# EAGLE board ION-60 (EAGLE 6.5.0), part 1 of 2
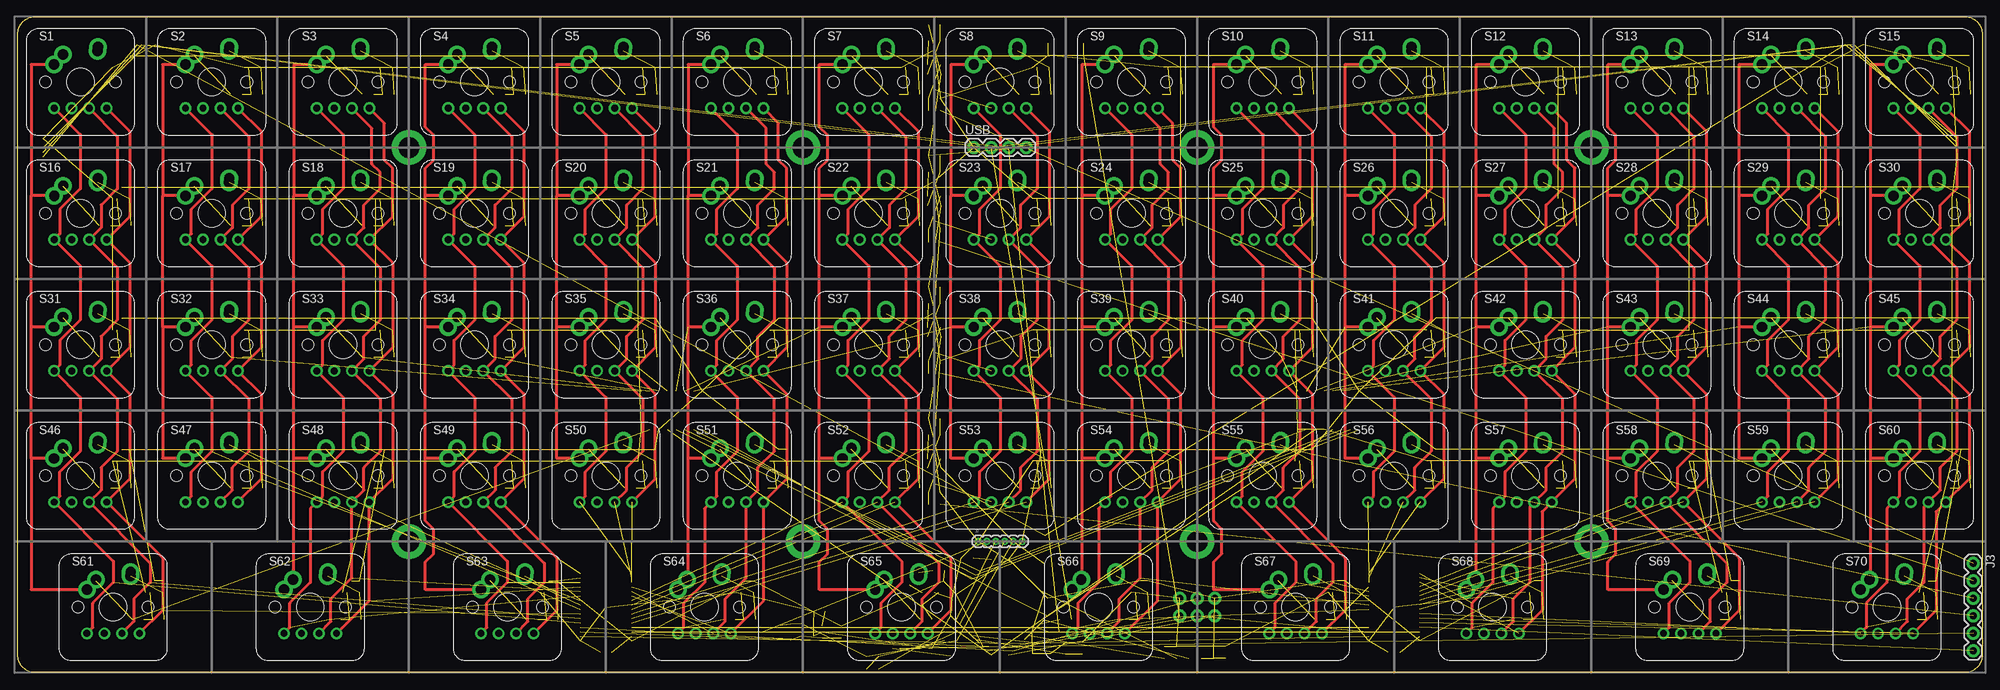
[diagram p2: board, top side]
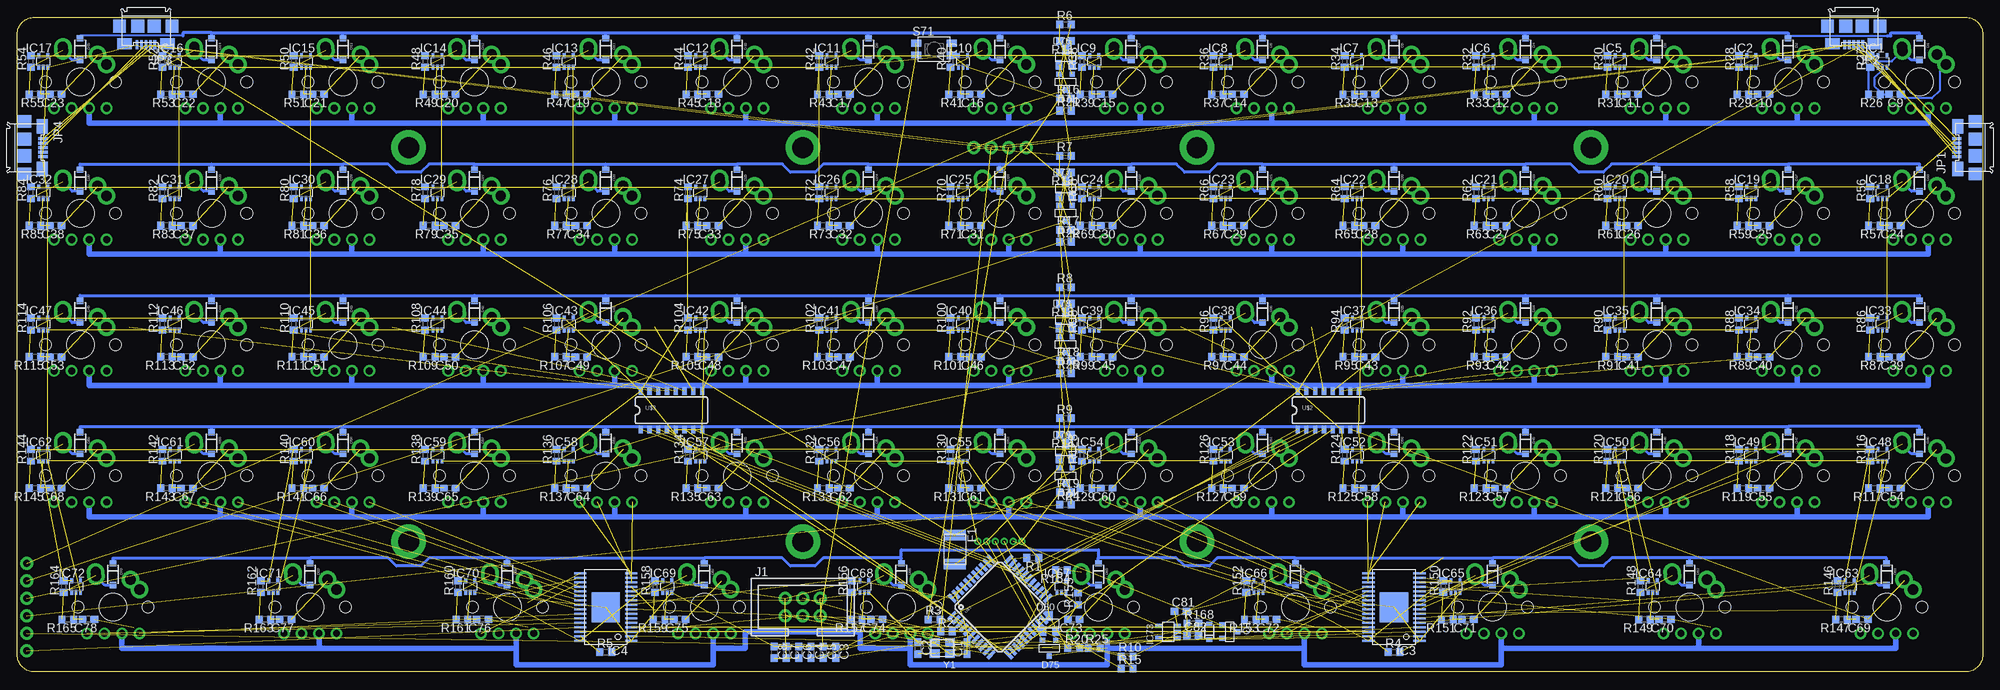
[diagram p3: board, bottom side, seen from below]

Size 285 x 95 mm. Coordinates in mm from the lower left corner, seen from the top.
Outline: 0,92.5 0,2.5 arc90 2.5,0 282.5,0 arc90 285,2.5 285,92.5 arc90 282.5,95 2.5,95 arc90 0,92.5
Copper layers (1*16): Top 0.035mm / dielectric 1.5mm / Bottom 0.035mm
Design rules "OSH Park 2-Layer DRC": minimum track width 8mil, minimum drill 13mil, track to track 6mil, track to pad 6mil, pad to pad 6mil, via to via 6mil, smd to smd 6mil, copper to edge 15mil, drill to drill 6mil, minimum pad ring 10mil, minimum via ring 7mil, stop-mask expansion 0mil, vias tented up to drill 16mil, thermal gap 10mil

## Footprints (pad centres in the part's own frame; a part is rotated, then mirrored left to right if it is on the bottom)
C0603 = smd 1.1 x 1: 1 -0.85,0; 2 0.85,0
SOD-123 = smd 0.9 x 0.95: A 1.575,0; C -1.575,0
SUPERSOT-3 = smd 0.762 x 0.762: 1 -0.953,-1.143; 2 0.953,-1.143; 3 0,1.143
SOT23 = smd 1 x 1.4: 1 -0.95,-1.1; 2 0.95,-1.1; 3 0,1.1
SOD-323 = smd 0.63 x 0.83: A 1.15,0; C -1.15,0
FUSE-1812 = smd 1.5 x 3.2: 1 -2.1,0; 2 2.1,0
SC70-5 = smd 0.4 x 0.7: 1 -0.65,-0.85; 2 0,-0.85; 3 0.65,-0.85; 4 0.65,0.85; 5 -0.65,0.85
HTSSOP-32 = smd 1.8 x 0.3: 1 -3.7,4.875; 2 -3.7,4.225; 3 -3.7,3.575; 4 -3.7,2.925; 5 -3.7,2.275; 6 -3.7,1.625; 7 -3.7,0.975; 8 -3.7,0.325; 9 -3.7,-0.325; 10 -3.7,-0.975; 11 -3.7,-1.625; 12 -3.7,-2.275; 13 -3.7,-2.925; 14 -3.7,-3.575; 15 -3.7,-4.225; 16 -3.7,-4.875; 17 3.7,-4.875; 18 3.7,-4.225; 19 3.7,-3.575; 20 3.7,-2.925; 21 3.7,-2.275; 22 3.7,-1.625; 23 3.7,-0.975; 24 3.7,-0.325; 25 3.7,0.325; 26 3.7,0.975; 27 3.7,1.625; 28 3.7,2.275; 29 3.7,2.925; 30 3.7,3.575; 31 3.7,4.225; 32 3.7,4.875 | smd 4.11 x 4.36: PAD 0,0
SOT23-5 = smd 0.55 x 1: 1 -0.85,-1.35; 2 0,-1.35; 3 0.85,-1.35; 4 0.85,1.35; 5 -0.85,1.35
M-2X03-0.1-PTH-SHROUDED = drill 1.016 pad 1.88: 1 -2.54,-1.27; 2 -2.54,1.27; 3 0,-1.27; 4 0,1.27; 5 2.54,-1.27; 6 2.54,1.27
M-1X06-0.05-PTH = drill 0.508 pad 1: 1 -3.175,0; 2 -1.905,0; 3 -0.635,0; 4 0.635,0; 5 1.905,0; 6 3.175,0
M-1X06-0.1-PTH = drill 1.016 pad 1.88: 1 -6.35,0; 2 -3.81,0; 3 -1.27,0; 4 1.27,0; 5 3.81,0; 6 6.35,0
USB-MICRO-B-SMD = smd 0.4 x 1.35: D+ 0,4.125; D- -0.65,4.125; GND 1.3,4.125; ID 0.65,4.125; VBUS -1.3,4.125 | smd 2.1 x 1.6: P$1 -3.1,4; P$2 3.1,4 | smd 1.8 x 1.9: P$3 -3.8,1.45; P$6 3.8,1.45 | smd 1.9 x 1.9: P$4 -1.2,1.45; P$5 1.2,1.45
R0603 = smd 1 x 1.1: 1 -0.85,0; 2 0.85,0
CHERRY-MX-LED-1X1 = drill 1 pad 1.7: D1 -3.81,-3.81; D2 3.81,-3.81; LED1 -1.27,-3.81; LED2 1.27,-3.81 | drill 1.5 pad 2.54: SW1 -3.81,2.54; SW2 2.54,5.08; SW3 -2.5,4; SW4 2.5,4.5 | hole 4: 0,0 | hole 1.7: -5.08,0; 5.08,0
CHERRY-MX-LED-1X1.5 = drill 1 pad 1.7: D1 -3.81,-3.81; D2 3.81,-3.81; LED1 -1.27,-3.81; LED2 1.27,-3.81 | drill 1.5 pad 2.54: SW1 -3.81,2.54; SW2 2.54,5.08; SW3 -2.5,4; SW4 2.5,4.5 | hole 4: 0,0 | hole 1.7: -5.08,0; 5.08,0
SWITCH-TACTILE-SMD = smd 1.45 x 1: 1 2.575,0.85; 2 2.575,-0.85; 3 -2.575,0.85; 4 -2.575,-0.85
TQFP44 = smd 1.5 x 0.5: 1 -5.8,4; 2 -5.8,3.2; 3 -5.8,2.4; 4 -5.8,1.6; 5 -5.8,0.8; 6 -5.8,0; 7 -5.8,-0.8; 8 -5.8,-1.6; 9 -5.8,-2.4; 10 -5.8,-3.2; 11 -5.8,-4; 23 5.8,-4; 24 5.8,-3.2; 25 5.8,-2.4; 26 5.8,-1.6; 27 5.8,-0.8; 28 5.8,0; 29 5.8,0.8; 30 5.8,1.6; 31 5.8,2.4; 32 5.8,3.2; 33 5.8,4 | smd 0.5 x 1.5: 12 -4,-5.8; 13 -3.2,-5.8; 14 -2.4,-5.8; 15 -1.6,-5.8; 16 -0.8,-5.8; 17 0,-5.8; 18 0.8,-5.8; 19 1.6,-5.8; 20 2.4,-5.8; 21 3.2,-5.8; 22 4,-5.8; 34 4,5.8; 35 3.2,5.8; 36 2.4,5.8; 37 1.6,5.8; 38 0.8,5.8; 39 0,5.8; 40 -0.8,5.8; 41 -1.6,5.8; 42 -2.4,5.8; 43 -3.2,5.8; 44 -4,5.8
SO016 = smd 0.6 x 1.2: 1 -4.445,-2.8; 2 -3.175,-2.8; 3 -1.905,-2.8; 4 -0.635,-2.8; 5 0.635,-2.8; 6 1.905,-2.8; 7 3.175,-2.8; 8 4.445,-2.8; 9 4.445,2.8; 10 3.175,2.8; 11 1.905,2.8; 12 0.635,2.8; 13 -0.635,2.8; 14 -1.905,2.8; 15 -3.175,2.8; 16 -4.445,2.8
M-1X04-0.1-PTH = drill 1.016 pad 1.88: 1 -3.81,0; 2 -1.27,0; 3 1.27,0; 4 3.81,0
CRYSTAL-SMD-3.2X2.5 = smd 1.4 x 1.2: 1 -1.1,-0.8; 2 1.1,-0.8; 3 1.1,0.8; 4 -1.1,0.8

## Placement (x,y rotation side)
C1  [C0603]  147.28,3.45 90 bottom
C2  [C0603]  154.43,3.45 270 bottom
C3  1uF  [C0603]  166.33,2.86 270 bottom
C4  1uF  [C0603]  169.9,2.86 270 bottom
C5  0.1uF  [C0603]  168.12,2.86 270 bottom
C6  0.1uF  [C0603]  171.69,2.86 270 bottom
C7  0.1uF  [C0603]  173.47,2.86 270 bottom
C8  0.1uF  [C0603]  175.26,2.86 270 bottom
C9  1uF  [C0603]  12.74,83.82 180 bottom
C10  1uF  [C0603]  31.79,83.82 180 bottom
C11  1uF  [C0603]  50.84,83.82 180 bottom
C12  1uF  [C0603]  69.89,83.82 180 bottom
C13  1uF  [C0603]  88.94,83.82 180 bottom
C14  1uF  [C0603]  107.99,83.82 180 bottom
C15  1uF  [C0603]  127.04,83.82 180 bottom
C16  1uF  [C0603]  146.09,83.82 180 bottom
C17  1uF  [C0603]  165.14,83.82 180 bottom
C18  1uF  [C0603]  184.19,83.82 180 bottom
C19  1uF  [C0603]  203.24,83.82 180 bottom
C20  1uF  [C0603]  222.29,83.82 180 bottom
C21  1uF  [C0603]  241.34,83.82 180 bottom
C22  1uF  [C0603]  260.39,83.82 180 bottom
C23  1uF  [C0603]  279.44,83.82 180 bottom
C24  1uF  [C0603]  12.74,64.77 180 bottom
C25  1uF  [C0603]  31.79,64.77 180 bottom
C26  1uF  [C0603]  50.84,64.77 180 bottom
C27  1uF  [C0603]  69.89,64.77 180 bottom
C28  1uF  [C0603]  88.94,64.77 180 bottom
C29  1uF  [C0603]  107.99,64.77 180 bottom
C30  1uF  [C0603]  127.04,64.77 180 bottom
C31  1uF  [C0603]  146.09,64.77 180 bottom
C32  1uF  [C0603]  165.14,64.77 180 bottom
C33  1uF  [C0603]  184.19,64.77 180 bottom
C34  1uF  [C0603]  203.24,64.77 180 bottom
C35  1uF  [C0603]  222.29,64.77 180 bottom
C36  1uF  [C0603]  241.34,64.77 180 bottom
C37  1uF  [C0603]  260.39,64.77 180 bottom
C38  1uF  [C0603]  279.44,64.77 180 bottom
C39  1uF  [C0603]  12.74,45.72 180 bottom
C40  1uF  [C0603]  31.79,45.72 180 bottom
C41  1uF  [C0603]  50.84,45.72 180 bottom
C42  1uF  [C0603]  69.89,45.72 180 bottom
C43  1uF  [C0603]  88.94,45.72 180 bottom
C44  1uF  [C0603]  107.99,45.72 180 bottom
C45  1uF  [C0603]  127.04,45.72 180 bottom
C46  1uF  [C0603]  146.09,45.72 180 bottom
C47  1uF  [C0603]  165.14,45.72 180 bottom
C48  1uF  [C0603]  184.19,45.72 180 bottom
C49  1uF  [C0603]  203.24,45.72 180 bottom
C50  1uF  [C0603]  222.29,45.72 180 bottom
C51  1uF  [C0603]  241.34,45.72 180 bottom
C52  1uF  [C0603]  260.39,45.72 180 bottom
C53  1uF  [C0603]  279.44,45.72 180 bottom
C54  1uF  [C0603]  12.74,26.67 180 bottom
C55  1uF  [C0603]  31.79,26.67 180 bottom
C56  1uF  [C0603]  50.84,26.67 180 bottom
C57  1uF  [C0603]  69.89,26.67 180 bottom
C58  1uF  [C0603]  88.94,26.67 180 bottom
C59  1uF  [C0603]  107.99,26.67 180 bottom
C60  1uF  [C0603]  127.04,26.67 180 bottom
C61  1uF  [C0603]  146.09,26.67 180 bottom
C62  1uF  [C0603]  165.14,26.67 180 bottom
C63  1uF  [C0603]  184.19,26.67 180 bottom
C64  1uF  [C0603]  203.24,26.67 180 bottom
C65  1uF  [C0603]  222.29,26.67 180 bottom
C66  1uF  [C0603]  241.34,26.67 180 bottom
C67  1uF  [C0603]  260.39,26.67 180 bottom
C68  1uF  [C0603]  279.44,26.67 180 bottom
C69  1uF  [C0603]  17.5,7.62 180 bottom
C70  1uF  [C0603]  46.08,7.62 180 bottom
C71  1uF  [C0603]  74.65,7.62 180 bottom
C72  1uF  [C0603]  103.23,7.62 180 bottom
C73  1uF  [C0603]  131.8,7.62 180 bottom
C74  1uF  [C0603]  160.38,7.62 180 bottom
C75  1uF  [C0603]  188.95,7.62 180 bottom
C76  1uF  [C0603]  217.53,7.62 180 bottom
C77  1uF  [C0603]  246.1,7.62 180 bottom
C78  1uF  [C0603]  274.68,7.62 180 bottom
C81  470pF  [C0603]  116.33,8.81 0 bottom
C82  1uF  [C0603]  114.54,5.24 0 bottom
D1  [SOD-123]  9.17,90.37 270 bottom
D2  [SOD-123]  28.22,90.37 270 bottom
D3  [SOD-123]  47.27,90.37 270 bottom
D4  [SOD-123]  66.32,90.37 270 bottom
D5  [SOD-123]  85.37,90.37 270 bottom
D6  [SOD-123]  104.42,90.37 270 bottom
D7  [SOD-123]  123.47,90.37 270 bottom
D8  [SOD-123]  142.52,90.37 270 bottom
D9  [SOD-123]  161.57,90.37 270 bottom
D10  [SOD-123]  180.62,90.37 270 bottom
D11  [SOD-123]  199.67,90.37 270 bottom
D12  [SOD-123]  218.72,90.37 270 bottom
D13  [SOD-123]  237.77,90.37 270 bottom
D14  [SOD-123]  256.82,90.37 270 bottom
D15  [SOD-123]  275.87,90.37 270 bottom
D16  [SOD-123]  9.17,71.32 270 bottom
D17  [SOD-123]  28.22,71.32 270 bottom
D18  [SOD-123]  47.27,71.32 270 bottom
D19  [SOD-123]  66.32,71.32 270 bottom
D20  [SOD-123]  85.37,71.32 270 bottom
D21  [SOD-123]  104.42,71.32 270 bottom
D22  [SOD-123]  123.47,71.32 270 bottom
D23  [SOD-123]  142.52,71.32 270 bottom
D24  [SOD-123]  161.57,71.32 270 bottom
D25  [SOD-123]  180.62,71.32 270 bottom
D26  [SOD-123]  199.67,71.32 270 bottom
D27  [SOD-123]  218.72,71.32 270 bottom
D28  [SOD-123]  237.77,71.32 270 bottom
D29  [SOD-123]  256.82,71.32 270 bottom
D30  [SOD-123]  275.87,71.32 270 bottom
D31  [SOD-123]  9.17,52.27 270 bottom
D32  [SOD-123]  28.22,52.27 270 bottom
D33  [SOD-123]  47.27,52.27 270 bottom
D34  [SOD-123]  66.32,52.27 270 bottom
D35  [SOD-123]  85.37,52.27 270 bottom
D36  [SOD-123]  104.42,52.27 270 bottom
D37  [SOD-123]  123.47,52.27 270 bottom
D38  [SOD-123]  142.52,52.27 270 bottom
D39  [SOD-123]  161.57,52.27 270 bottom
D40  [SOD-123]  180.62,52.27 270 bottom
D41  [SOD-123]  199.67,52.27 270 bottom
D42  [SOD-123]  218.72,52.27 270 bottom
D43  [SOD-123]  237.77,52.27 270 bottom
D44  [SOD-123]  256.82,52.27 270 bottom
D45  [SOD-123]  275.87,52.27 270 bottom
D46  [SOD-123]  9.17,33.22 270 bottom
D47  [SOD-123]  28.22,33.22 270 bottom
D48  [SOD-123]  47.27,33.22 270 bottom
D49  [SOD-123]  66.32,33.22 270 bottom
D50  [SOD-123]  85.37,33.22 270 bottom
D51  [SOD-123]  104.42,33.22 270 bottom
D52  [SOD-123]  123.47,33.22 270 bottom
D53  [SOD-123]  142.52,33.22 270 bottom
D54  [SOD-123]  161.57,33.22 270 bottom
D55  [SOD-123]  180.62,33.22 270 bottom
D56  [SOD-123]  199.67,33.22 270 bottom
D57  [SOD-123]  218.72,33.22 270 bottom
D58  [SOD-123]  237.77,33.22 270 bottom
D59  [SOD-123]  256.82,33.22 270 bottom
D60  [SOD-123]  275.87,33.22 270 bottom
D61  [SOD-123]  13.93,14.17 270 bottom
D62  [SOD-123]  42.51,14.17 270 bottom
D63  [SOD-123]  71.08,14.17 270 bottom
D64  [SOD-123]  99.66,14.17 270 bottom
D65  [SOD-123]  128.23,14.17 270 bottom
D66  [SOD-123]  156.81,14.17 270 bottom
D67  [SOD-123]  185.38,14.17 270 bottom
D68  [SOD-123]  213.96,14.17 270 bottom
D69  [SOD-123]  242.53,14.17 270 bottom
D70  [SOD-123]  271.11,14.17 270 bottom
D71  MOSFET-PSUPERSOT  [SUPERSOT-3]  132.99,85.61 180 bottom
D72  MOSFET-PSUPERSOT  [SUPERSOT-3]  132.99,66.56 180 bottom
D73  MOSFET-PSUPERSOT  [SUPERSOT-3]  132.99,47.51 180 bottom
D74  MOSFET-PSUPERSOT  [SUPERSOT-3]  132.99,28.46 180 bottom
D75  MOSFET-PSUPERSOT  [SUPERSOT-3]  135.38,3.45 180 bottom
D76  [SOT23]  132.99,89.18 0 bottom
D77  [SOT23]  132.99,70.13 0 bottom
D78  [SOT23]  132.99,51.08 0 bottom
D79  [SOT23]  132.99,32.03 0 bottom
D80  [SOT23]  135.38,7.03 0 bottom
D81  BAT20J  [SOD-323]  112.16,5.83 90 bottom
F1  500mA  [FUSE-1812]  149.07,17.74 270 bottom
IC1  74LVC1G14DCK  [SC70-5]  14.53,88.58 0 bottom
IC2  74LVC1G14DCK  [SC70-5]  33.58,88.58 0 bottom
IC3  TLC5947DAP  [HTSSOP-32]  85.37,9.41 180 bottom
IC4  TLC5947DAP  [HTSSOP-32]  199.67,9.41 180 bottom
IC5  74LVC1G14DCK  [SC70-5]  52.63,88.58 0 bottom
IC6  74LVC1G14DCK  [SC70-5]  71.68,88.58 0 bottom
IC7  74LVC1G14DCK  [SC70-5]  90.73,88.58 0 bottom
IC8  74LVC1G14DCK  [SC70-5]  109.78,88.58 0 bottom
IC9  74LVC1G14DCK  [SC70-5]  128.83,88.58 0 bottom
IC10  74LVC1G14DCK  [SC70-5]  147.88,88.58 0 bottom
IC11  74LVC1G14DCK  [SC70-5]  166.93,88.58 0 bottom
IC12  74LVC1G14DCK  [SC70-5]  185.98,88.58 0 bottom
IC13  74LVC1G14DCK  [SC70-5]  205.03,88.58 0 bottom
IC14  74LVC1G14DCK  [SC70-5]  224.08,88.58 0 bottom
IC15  74LVC1G14DCK  [SC70-5]  243.13,88.58 0 bottom
IC16  74LVC1G14DCK  [SC70-5]  262.18,88.58 0 bottom
IC17  74LVC1G14DCK  [SC70-5]  281.23,88.58 0 bottom
IC18  74LVC1G14DCK  [SC70-5]  14.53,69.53 0 bottom
IC19  74LVC1G14DCK  [SC70-5]  33.58,69.53 0 bottom
IC20  74LVC1G14DCK  [SC70-5]  52.63,69.53 0 bottom
IC21  74LVC1G14DCK  [SC70-5]  71.68,69.53 0 bottom
IC22  74LVC1G14DCK  [SC70-5]  90.73,69.53 0 bottom
IC23  74LVC1G14DCK  [SC70-5]  109.78,69.53 0 bottom
IC24  74LVC1G14DCK  [SC70-5]  128.83,69.53 0 bottom
IC25  74LVC1G14DCK  [SC70-5]  147.88,69.53 0 bottom
IC26  74LVC1G14DCK  [SC70-5]  166.93,69.53 0 bottom
IC27  74LVC1G14DCK  [SC70-5]  185.98,69.53 0 bottom
IC28  74LVC1G14DCK  [SC70-5]  205.03,69.53 0 bottom
IC29  74LVC1G14DCK  [SC70-5]  224.08,69.53 0 bottom
IC30  74LVC1G14DCK  [SC70-5]  243.13,69.53 0 bottom
IC31  74LVC1G14DCK  [SC70-5]  262.18,69.53 0 bottom
IC32  74LVC1G14DCK  [SC70-5]  281.23,69.53 0 bottom
IC33  74LVC1G14DCK  [SC70-5]  14.53,50.48 0 bottom
IC34  74LVC1G14DCK  [SC70-5]  33.58,50.48 0 bottom
IC35  74LVC1G14DCK  [SC70-5]  52.63,50.48 0 bottom
IC36  74LVC1G14DCK  [SC70-5]  71.68,50.48 0 bottom
IC37  74LVC1G14DCK  [SC70-5]  90.73,50.48 0 bottom
IC38  74LVC1G14DCK  [SC70-5]  109.78,50.48 0 bottom
IC39  74LVC1G14DCK  [SC70-5]  128.83,50.48 0 bottom
IC40  74LVC1G14DCK  [SC70-5]  147.88,50.48 0 bottom
IC41  74LVC1G14DCK  [SC70-5]  166.93,50.48 0 bottom
IC42  74LVC1G14DCK  [SC70-5]  185.98,50.48 0 bottom
IC43  74LVC1G14DCK  [SC70-5]  205.03,50.48 0 bottom
IC44  74LVC1G14DCK  [SC70-5]  224.08,50.48 0 bottom
IC45  74LVC1G14DCK  [SC70-5]  243.13,50.48 0 bottom
IC46  74LVC1G14DCK  [SC70-5]  262.18,50.48 0 bottom
IC47  74LVC1G14DCK  [SC70-5]  281.23,50.48 0 bottom
IC48  74LVC1G14DCK  [SC70-5]  14.53,31.43 0 bottom
IC49  74LVC1G14DCK  [SC70-5]  33.58,31.43 0 bottom
IC50  74LVC1G14DCK  [SC70-5]  52.63,31.43 0 bottom
IC51  74LVC1G14DCK  [SC70-5]  71.68,31.43 0 bottom
IC52  74LVC1G14DCK  [SC70-5]  90.73,31.43 0 bottom
IC53  74LVC1G14DCK  [SC70-5]  109.78,31.43 0 bottom
IC54  74LVC1G14DCK  [SC70-5]  128.83,31.43 0 bottom
IC55  74LVC1G14DCK  [SC70-5]  147.88,31.43 0 bottom
IC56  74LVC1G14DCK  [SC70-5]  166.93,31.43 0 bottom
IC57  74LVC1G14DCK  [SC70-5]  185.98,31.43 0 bottom
IC58  74LVC1G14DCK  [SC70-5]  205.03,31.43 0 bottom
IC59  74LVC1G14DCK  [SC70-5]  224.08,31.43 0 bottom
IC60  74LVC1G14DCK  [SC70-5]  243.13,31.43 0 bottom
IC61  74LVC1G14DCK  [SC70-5]  262.18,31.43 0 bottom
IC62  74LVC1G14DCK  [SC70-5]  281.23,31.43 0 bottom
IC63  74LVC1G14DCK  [SC70-5]  19.29,12.38 0 bottom
IC64  74LVC1G14DCK  [SC70-5]  47.86,12.38 0 bottom
IC65  74LVC1G14DCK  [SC70-5]  76.44,12.38 0 bottom
IC66  74LVC1G14DCK  [SC70-5]  105.01,12.38 0 bottom
IC67  74LVC1G14DCK  [SC70-5]  133.59,12.38 0 bottom
IC68  74LVC1G14DCK  [SC70-5]  162.16,12.38 0 bottom
IC69  74LVC1G14DCK  [SC70-5]  190.74,12.38 0 bottom
IC70  74LVC1G14DCK  [SC70-5]  219.31,12.38 0 bottom
IC71  74LVC1G14DCK  [SC70-5]  247.89,12.38 0 bottom
IC72  74LVC1G14DCK  [SC70-5]  276.46,12.38 0 bottom
IC73  VREG-5SOT23  [SOT23-5]  118.11,5.83 90 bottom
J1  [M-2X03-0.1-PTH-SHROUDED]  171.09,9.41 0 bottom
J2  change  [M-1X06-0.05-PTH]  142.52,18.93 0 top
J3  [M-1X06-0.1-PTH]  283.61,9.41 270 top
JP1  USB-MICROBSMD  [USB-MICRO-B-SMD]  -0.36,76.08 90 bottom
JP2  USB-MICROBSMD  [USB-MICRO-B-SMD]  18.69,95.13 180 bottom
JP3  USB-MICROBSMD  [USB-MICRO-B-SMD]  266.34,95.13 180 bottom
JP4  USB-MICROBSMD  [USB-MICRO-B-SMD]  285.39,76.08 270 bottom
Q1  MOSFET-PSUPERSOT  [SUPERSOT-3]  109.18,5.83 270 bottom
R1  1K  [R0603]  137.76,16.55 180 bottom
R2  22  [R0603]  150.26,5.83 0 bottom
R3  22  [R0603]  152.04,7.62 0 bottom
R4  4.7k/5.1k  [R0603]  85.37,2.86 0 bottom
R5  4.7k/5.1k  [R0603]  199.67,2.86 0 bottom
R6  4.7k  [R0603]  132.99,93.94 0 bottom
R7  4.7k  [R0603]  132.99,74.89 0 bottom
R8  4.7k  [R0603]  132.99,55.84 0 bottom
R9  4.7k  [R0603]  132.99,36.79 0 bottom
R10  4.7k  [R0603]  124.06,2.26 0 bottom
R11  100  [R0603]  132.99,91.56 180 bottom
R12  100  [R0603]  132.99,72.51 180 bottom
R13  100  [R0603]  132.99,53.46 180 bottom
R14  100  [R0603]  132.99,34.41 180 bottom
R15  100  [R0603]  124.06,0.48 0 bottom
R16  4.7k  [R0603]  132.99,83.22 0 bottom
R17  4.7k  [R0603]  132.99,64.17 0 bottom
R18  4.7k  [R0603]  132.99,45.12 0 bottom
R19  4.7k  [R0603]  132.99,26.07 0 bottom
R20  4.7k  [R0603]  131.8,3.45 0 bottom
R21  100  [R0603]  132.99,81.44 0 bottom
R22  100  [R0603]  132.99,62.39 0 bottom
R23  100  [R0603]  132.99,43.34 0 bottom
R24  100  [R0603]  132.99,24.29 0 bottom
R25  100  [R0603]  128.83,3.45 0 bottom
R26  22k?  [R0603]  15.72,83.82 180 bottom
R27  4.7k?  [R0603]  16.31,88.58 90 bottom
R28  4.7k?  [R0603]  35.36,88.58 90 bottom
R29  22k?  [R0603]  34.77,83.82 180 bottom
R30  4.7k?  [R0603]  54.41,88.58 90 bottom
R31  22k?  [R0603]  53.82,83.82 180 bottom
R32  4.7k?  [R0603]  73.46,88.58 90 bottom
R33  22k?  [R0603]  72.87,83.82 180 bottom
R34  4.7k?  [R0603]  92.51,88.58 90 bottom
R35  22k?  [R0603]  91.92,83.82 180 bottom
R36  4.7k?  [R0603]  111.56,88.58 90 bottom
R37  22k?  [R0603]  110.97,83.82 180 bottom
R38  4.7k?  [R0603]  130.61,88.58 90 bottom
R39  22k?  [R0603]  130.02,83.82 180 bottom
R40  4.7k?  [R0603]  149.66,88.58 90 bottom
R41  22k?  [R0603]  149.07,83.82 180 bottom
R42  4.7k?  [R0603]  168.71,88.58 90 bottom
R43  22k?  [R0603]  168.12,83.82 180 bottom
R44  4.7k?  [R0603]  187.76,88.58 90 bottom
R45  22k?  [R0603]  187.17,83.82 180 bottom
R46  4.7k?  [R0603]  206.81,88.58 90 bottom
R47  22k?  [R0603]  206.22,83.82 180 bottom
R48  4.7k?  [R0603]  225.86,88.58 90 bottom
R49  22k?  [R0603]  225.27,83.82 180 bottom
R50  4.7k?  [R0603]  244.91,88.58 90 bottom
R51  22k?  [R0603]  244.32,83.82 180 bottom
R52  4.7k?  [R0603]  263.96,88.58 90 bottom
R53  22k?  [R0603]  263.37,83.82 180 bottom
R54  4.7k?  [R0603]  283.01,88.58 90 bottom
R55  22k?  [R0603]  282.42,83.82 180 bottom
R56  4.7k?  [R0603]  16.31,69.53 90 bottom
R57  22k?  [R0603]  15.72,64.77 180 bottom
R58  4.7k?  [R0603]  35.36,69.53 90 bottom
R59  22k?  [R0603]  34.77,64.77 180 bottom
R60  4.7k?  [R0603]  54.41,69.53 90 bottom
R61  22k?  [R0603]  53.82,64.77 180 bottom
R62  4.7k?  [R0603]  73.46,69.53 90 bottom
R63  22k?  [R0603]  72.87,64.77 180 bottom
R64  4.7k?  [R0603]  92.51,69.53 90 bottom
R65  22k?  [R0603]  91.92,64.77 180 bottom
R66  4.7k?  [R0603]  111.56,69.53 90 bottom
R67  22k?  [R0603]  110.97,64.77 180 bottom
R68  4.7k?  [R0603]  130.61,69.53 90 bottom
R69  22k?  [R0603]  130.02,64.77 180 bottom
R70  4.7k?  [R0603]  149.66,69.53 90 bottom
R71  22k?  [R0603]  149.07,64.77 180 bottom
R72  4.7k?  [R0603]  168.71,69.53 90 bottom
R73  22k?  [R0603]  168.12,64.77 180 bottom
R74  4.7k?  [R0603]  187.76,69.53 90 bottom
R75  22k?  [R0603]  187.17,64.77 180 bottom
R76  4.7k?  [R0603]  206.81,69.53 90 bottom
R77  22k?  [R0603]  206.22,64.77 180 bottom
R78  4.7k?  [R0603]  225.86,69.53 90 bottom
R79  22k?  [R0603]  225.27,64.77 180 bottom
R80  4.7k?  [R0603]  244.91,69.53 90 bottom
R81  22k?  [R0603]  244.32,64.77 180 bottom
R82  4.7k?  [R0603]  263.96,69.53 90 bottom
R83  22k?  [R0603]  263.37,64.77 180 bottom
R84  4.7k?  [R0603]  283.01,69.53 90 bottom
R85  22k?  [R0603]  282.42,64.77 180 bottom
R86  4.7k?  [R0603]  16.31,50.48 90 bottom
R87  22k?  [R0603]  15.72,45.72 180 bottom
R88  4.7k?  [R0603]  35.36,50.48 90 bottom
R89  22k?  [R0603]  34.77,45.72 180 bottom
R90  4.7k?  [R0603]  54.41,50.48 90 bottom
R91  22k?  [R0603]  53.82,45.72 180 bottom
R92  4.7k?  [R0603]  73.46,50.48 90 bottom
R93  22k?  [R0603]  72.87,45.72 180 bottom
R94  4.7k?  [R0603]  92.51,50.48 90 bottom
R95  22k?  [R0603]  91.92,45.72 180 bottom
R96  4.7k?  [R0603]  111.56,50.48 90 bottom
R97  22k?  [R0603]  110.97,45.72 180 bottom
R98  4.7k?  [R0603]  130.61,50.48 90 bottom
R99  22k?  [R0603]  130.02,45.72 180 bottom
R100  4.7k?  [R0603]  149.66,50.48 90 bottom
R101  22k?  [R0603]  149.07,45.72 180 bottom
R102  4.7k?  [R0603]  168.71,50.48 90 bottom
R103  22k?  [R0603]  168.12,45.72 180 bottom
R104  4.7k?  [R0603]  187.76,50.48 90 bottom
R105  22k?  [R0603]  187.17,45.72 180 bottom
R106  4.7k?  [R0603]  206.81,50.48 90 bottom
R107  22k?  [R0603]  206.22,45.72 180 bottom
R108  4.7k?  [R0603]  225.86,50.48 90 bottom
R109  22k?  [R0603]  225.27,45.72 180 bottom
R110  4.7k?  [R0603]  244.91,50.48 90 bottom
R111  22k?  [R0603]  244.32,45.72 180 bottom
R112  4.7k?  [R0603]  263.96,50.48 90 bottom
R113  22k?  [R0603]  263.37,45.72 180 bottom
R114  4.7k?  [R0603]  283.01,50.48 90 bottom
R115  22k?  [R0603]  282.42,45.72 180 bottom
R116  4.7k?  [R0603]  16.31,31.43 90 bottom
R117  22k?  [R0603]  15.72,26.67 180 bottom
R118  4.7k?  [R0603]  35.36,31.43 90 bottom
R119  22k?  [R0603]  34.77,26.67 180 bottom
R120  4.7k?  [R0603]  54.41,31.43 90 bottom
R121  22k?  [R0603]  53.82,26.67 180 bottom
R122  4.7k?  [R0603]  73.46,31.43 90 bottom
R123  22k?  [R0603]  72.87,26.67 180 bottom
R124  4.7k?  [R0603]  92.51,31.43 90 bottom
R125  22k?  [R0603]  91.92,26.67 180 bottom
R126  4.7k?  [R0603]  111.56,31.43 90 bottom
R127  22k?  [R0603]  110.97,26.67 180 bottom
R128  4.7k?  [R0603]  130.61,31.43 90 bottom
R129  22k?  [R0603]  130.02,26.67 180 bottom
R130  4.7k?  [R0603]  149.66,31.43 90 bottom
R131  22k?  [R0603]  149.07,26.67 180 bottom
R132  4.7k?  [R0603]  168.71,31.43 90 bottom
R133  22k?  [R0603]  168.12,26.67 180 bottom
R134  4.7k?  [R0603]  187.76,31.43 90 bottom
R135  22k?  [R0603]  187.17,26.67 180 bottom
R136  4.7k?  [R0603]  206.81,31.43 90 bottom
R137  22k?  [R0603]  206.22,26.67 180 bottom
R138  4.7k?  [R0603]  225.86,31.43 90 bottom
R139  22k?  [R0603]  225.27,26.67 180 bottom
R140  4.7k?  [R0603]  244.91,31.43 90 bottom
R141  22k?  [R0603]  244.32,26.67 180 bottom
R142  4.7k?  [R0603]  263.96,31.43 90 bottom
R143  22k?  [R0603]  263.37,26.67 180 bottom
R144  4.7k?  [R0603]  283.01,31.43 90 bottom
R145  22k?  [R0603]  282.42,26.67 180 bottom
R146  4.7k?  [R0603]  21.07,12.38 90 bottom
R147  22k?  [R0603]  20.48,7.62 180 bottom
R148  4.7k?  [R0603]  49.65,12.38 90 bottom
R149  22k?  [R0603]  49.05,7.62 180 bottom
R150  4.7k?  [R0603]  78.22,12.38 90 bottom
R151  22k?  [R0603]  77.63,7.62 180 bottom
R152  4.7k?  [R0603]  106.8,12.38 90 bottom
R153  22k?  [R0603]  106.2,7.62 180 bottom
R154  4.7k?  [R0603]  133.59,14.76 180 bottom
R155  22k?  [R0603]  131.21,10.6 90 bottom
R156  4.7k?  [R0603]  163.95,12.38 90 bottom
R157  22k?  [R0603]  163.35,7.62 180 bottom
R158  4.7k?  [R0603]  192.53,12.38 90 bottom
R159  22k?  [R0603]  191.93,7.62 180 bottom
R160  4.7k?  [R0603]  221.1,12.38 90 bottom
R161  22k?  [R0603]  220.5,7.62 180 bottom
R162  4.7k?  [R0603]  249.68,12.38 90 bottom
R163  22k?  [R0603]  249.08,7.62 180 bottom
R164  4.7k?  [R0603]  278.25,12.38 90 bottom
R165  22k?  [R0603]  277.65,7.62 180 bottom
R168  100K  [R0603]  114.54,7.03 0 bottom
S1  [CHERRY-MX-LED-1X1]  9.15,85.6 0 top
S2  [CHERRY-MX-LED-1X1]  28.2,85.6 0 top
S3  [CHERRY-MX-LED-1X1]  47.25,85.6 0 top
S4  [CHERRY-MX-LED-1X1]  66.3,85.6 0 top
S5  [CHERRY-MX-LED-1X1]  85.35,85.6 0 top
S6  [CHERRY-MX-LED-1X1]  104.4,85.6 0 top
S7  [CHERRY-MX-LED-1X1]  123.45,85.6 0 top
S8  [CHERRY-MX-LED-1X1]  142.5,85.6 0 top
S9  [CHERRY-MX-LED-1X1]  161.55,85.6 0 top
S10  [CHERRY-MX-LED-1X1]  180.6,85.6 0 top
S11  [CHERRY-MX-LED-1X1]  199.65,85.6 0 top
S12  [CHERRY-MX-LED-1X1]  218.7,85.6 0 top
S13  [CHERRY-MX-LED-1X1]  237.75,85.6 0 top
S14  [CHERRY-MX-LED-1X1]  256.8,85.6 0 top
S15  [CHERRY-MX-LED-1X1]  275.85,85.6 0 top
S16  [CHERRY-MX-LED-1X1]  9.17,66.56 0 top
S17  [CHERRY-MX-LED-1X1]  28.2,66.55 0 top
S18  [CHERRY-MX-LED-1X1]  47.25,66.55 0 top
S19  [CHERRY-MX-LED-1X1]  66.3,66.55 0 top
S20  [CHERRY-MX-LED-1X1]  85.35,66.55 0 top
S21  [CHERRY-MX-LED-1X1]  104.4,66.55 0 top
S22  [CHERRY-MX-LED-1X1]  123.45,66.55 0 top
S23  [CHERRY-MX-LED-1X1]  142.5,66.55 0 top
S24  [CHERRY-MX-LED-1X1]  161.55,66.55 0 top
S25  [CHERRY-MX-LED-1X1]  180.6,66.55 0 top
S26  [CHERRY-MX-LED-1X1]  199.65,66.55 0 top
S27  [CHERRY-MX-LED-1X1]  218.7,66.55 0 top
S28  [CHERRY-MX-LED-1X1]  237.75,66.55 0 top
S29  [CHERRY-MX-LED-1X1]  256.8,66.55 0 top
S30  [CHERRY-MX-LED-1X1]  275.85,66.55 0 top
S31  [CHERRY-MX-LED-1X1]  9.15,47.5 0 top
S32  [CHERRY-MX-LED-1X1]  28.2,47.5 0 top
S33  [CHERRY-MX-LED-1X1]  47.25,47.5 0 top
S34  [CHERRY-MX-LED-1X1]  66.3,47.5 0 top
S35  [CHERRY-MX-LED-1X1]  85.35,47.5 0 top
S36  [CHERRY-MX-LED-1X1]  104.4,47.5 0 top
S37  [CHERRY-MX-LED-1X1]  123.45,47.5 0 top
S38  [CHERRY-MX-LED-1X1]  142.5,47.5 0 top
S39  [CHERRY-MX-LED-1X1]  161.55,47.5 0 top
S40  [CHERRY-MX-LED-1X1]  180.6,47.5 0 top
S41  [CHERRY-MX-LED-1X1]  199.65,47.5 0 top
S42  [CHERRY-MX-LED-1X1]  218.7,47.5 0 top
S43  [CHERRY-MX-LED-1X1]  237.75,47.5 0 top
S44  [CHERRY-MX-LED-1X1]  256.8,47.5 0 top
S45  [CHERRY-MX-LED-1X1]  275.85,47.5 0 top
S46  [CHERRY-MX-LED-1X1]  9.15,28.45 0 top
S47  [CHERRY-MX-LED-1X1]  28.2,28.45 0 top
S48  [CHERRY-MX-LED-1X1]  47.25,28.45 0 top
S49  [CHERRY-MX-LED-1X1]  66.3,28.45 0 top
S50  [CHERRY-MX-LED-1X1]  85.35,28.45 0 top
S51  [CHERRY-MX-LED-1X1]  104.4,28.45 0 top
S52  [CHERRY-MX-LED-1X1]  123.45,28.45 0 top
S53  [CHERRY-MX-LED-1X1]  142.5,28.45 0 top
S54  [CHERRY-MX-LED-1X1]  161.55,28.45 0 top
S55  [CHERRY-MX-LED-1X1]  180.6,28.45 0 top
S56  [CHERRY-MX-LED-1X1]  199.65,28.45 0 top
S57  [CHERRY-MX-LED-1X1]  218.7,28.45 0 top
S58  [CHERRY-MX-LED-1X1]  237.75,28.45 0 top
S59  [CHERRY-MX-LED-1X1]  256.8,28.45 0 top
S60  [CHERRY-MX-LED-1X1]  275.85,28.45 0 top
S61  [CHERRY-MX-LED-1X1.5]  13.91,9.4 0 top
S62  [CHERRY-MX-LED-1X1.5]  42.49,9.4 0 top
S63  [CHERRY-MX-LED-1X1.5]  71.06,9.4 0 top
S64  [CHERRY-MX-LED-1X1.5]  99.64,9.4 0 top
S65  [CHERRY-MX-LED-1X1.5]  128.21,9.4 0 top
S66  [CHERRY-MX-LED-1X1.5]  156.79,9.4 0 top
S67  [CHERRY-MX-LED-1X1.5]  185.36,9.4 0 top
S68  [CHERRY-MX-LED-1X1.5]  213.94,9.4 0 top
S69  [CHERRY-MX-LED-1X1.5]  242.51,9.4 0 top
S70  [CHERRY-MX-LED-1X1.5]  271.09,9.4 0 top
S71  change  [SWITCH-TACTILE-SMD]  152.04,90.37 0 bottom
U$1  ATMEGA32U4TQFP-44  [TQFP44]  142.52,9.41 45 bottom
U$2  74LVC138AD  [SO016]  94.89,37.98 0 bottom
U$3  74LVC138AD  [SO016]  190.14,37.98 0 bottom
USB  [M-1X04-0.1-PTH]  142.52,76.08 0 top
Y1  16MHz  [CRYSTAL-SMD-3.2X2.5]  150.85,3.45 180 bottom